# EasyEDA schematic Schematic_Open433_2020-06-17_01-57-08.json
TITLE: Sheet_1; REV: 1.0; Date: 2020-03-05; Sheet: 1/1; Drawn By: TurtleForGaming; Company: Your Company
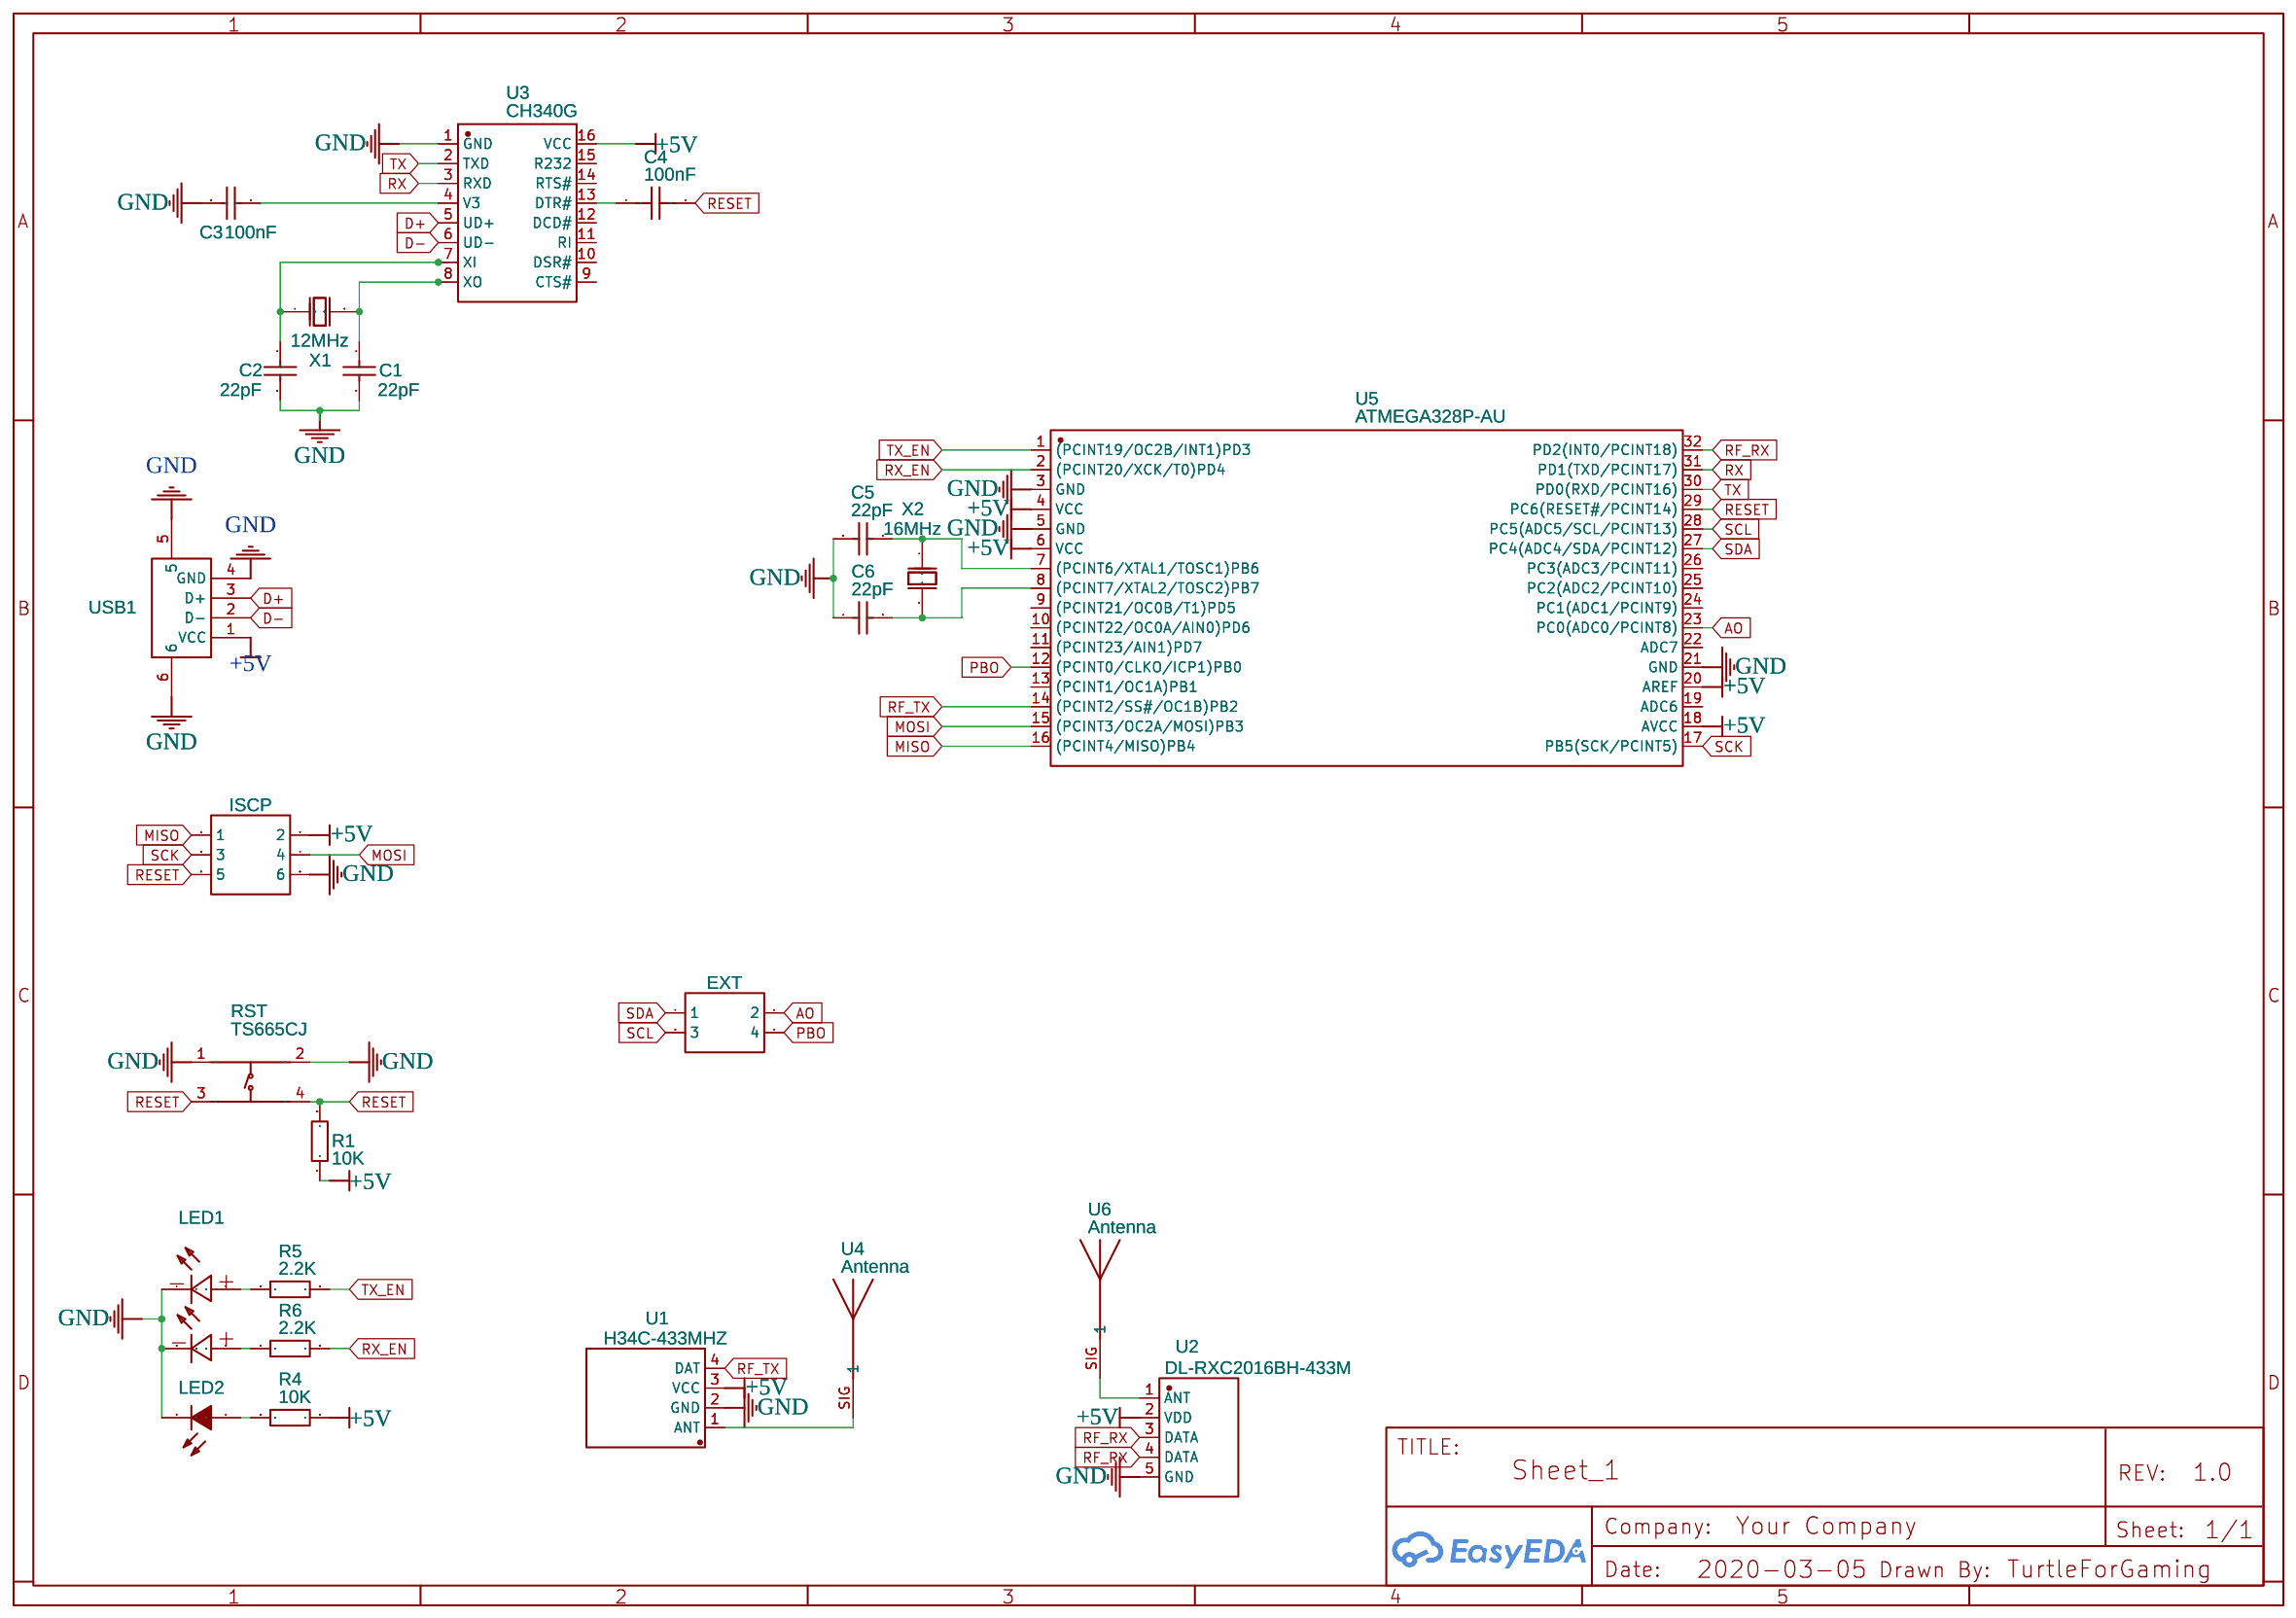
[diagram p0: schematic sheet]

## Parts
C1  22pF  [C1206]
C2  22pF  [C1206]
C3  100nF  [C1206]
C4  100nF  [C1206]
C5  22pF  [C1206]
C6  22pF  [C1206]
EXT  HDR-M-2.54_2x2  [HDR-M-2.54_2X2]
ISCP  Header-Female-2.54_2x3  [HDR-3X2/2.54]
LED1  19-223/Y2R6C-A01/2T  [LED-ARRAY-SMD_4P-L1.6-W1.5-TR-RD]
LED2  19-217/GHC-YR1S2/3T  [LED0603-R-RD]
R1  10K  [R1206]
R4  10K  [R1206]
R5  2.2K  [R0603]
R6  2.2K  [R0603]
RST  TS665CJ  [SW-TH_4P-L6.0-W6.0-P4.50-LS6.5]
U1  H34C-433MHZ  [WIRELM-TH_H34C-433MHZ]
U2  DL-RXC2016BH-433M  [WIRELM-TH_DL-RXC2016BH-433M]
U3  CH340G  [SOIC-16_L9.9-W3.9-P1.27-LS6.0-BL]
U4  Antenna  [PCBANTENNA]
U5  ATMEGA328P-AU  [TQFP-32_L7.0-W7.0-P0.80-LS9.0-BL]
U6  Antenna  [PCBANTENNA]
USB1  U217-04XN-XXR84  [USB-A-SMD_U217-041N-4BV81]
X1  12MHz  [HC-49S_L11.4-W4.8]
X2  16MHz  [HC-49S_L11.4-W4.8]

## Library data of the parts
C1 C2 C5 C6 = 1206CG220J500NT: Supplier: LCSC; Manufacturer: FH; Supplier Part: C1896
C3 = GRM31C5C1H104JA01L: Supplier: LCSC; Manufacturer: MuRata; Supplier Part: C97946
C4 = FM31X104K251EEG: Supplier: LCSC; Supplier Part: C365814; Manufacturer: Prosperity Dielectrics; Contributor: LCSC
EXT = HDR-M-2.54_2x2: Supplier Part: C66690; Supplier: LCSC; Contributor: LCEDA_Lib
ISCP = Header-Female-2.54_2x3: Supplier: LCSC; Manufacturer: CONNFLY; Manufacturer Part: DS1023-2*3SF11; Contributor: LCSC; Supplier Part: C92272
LED1 = 19-223/Y2R6C-A01/2T: Supplier: LCSC; Supplier Part: C282134; Manufacturer: Everlight Elec; Contributor: LCSC
LED2 = 19-217/GHC-YR1S2/3T: Supplier: LCSC; Manufacturer: EVERLIGHT; LCSC Assembly: Yes; image: //image.lceda.cn/szlcsc/C72043.jpg; Supplier Part: C72043; SMT Type: Basic
R1 R4 = CR-06JL7---10K: Supplier: LCSC; Supplier Part: C280032; Manufacturer: Viking Tech; Contributor: LCSC
R5 R6 = QR0603F2K2P05: Supplier: LCSC; Supplier Part: C176136; Manufacturer: Ever Ohms Tech; Contributor: LCSC
RST = TS665CJ: Supplier: LCSC; Supplier Part: C393938; Manufacturer: SHOU HAN; Contributor: LCSC
U1 = H34C-433MHZ: Supplier: LCSC; Supplier Part: C131030; Manufacturer: Shenzhen LCHSTAR Elec; Contributor: LCSC
U2 = DL-RXC2016BH-433M: Supplier: LCSC; Supplier Part: C381154; Manufacturer: DreamLNK; Contributor: LCSC
U3 = CH340G: Supplier: LCSC; Manufacturer: WCH; LCSC Assembly: Yes; image: //image.lceda.cn/szlcsc/C14267.jpg; Supplier Part: C14267; SMT Type: Basic
U4 U6 = Antenna: Manufacturer Part: ANT; Contributor: Gamer
U5 = ATMEGA328P-AU: Supplier: LCSC; Manufacturer: MICROCHIP; image: //image.lceda.cn/szlcsc/C14877.jpg; Supplier Part: C14877; LCSC Assembly: Yes; SMT Type: Extend
USB1 = U217-04XN-XXR84: Supplier: LCSC; Supplier Part: C319178; Manufacturer: XKB Enterprise; Contributor: LCSC
X1 = C12000J517: Supplier: LCSC; Supplier Part: C279578; Manufacturer: ZheJiang East Crystal Elec; Contributor: LCSC
X2 = 49MD-16.000-20-20-20/A: Supplier: LCSC; Supplier Part: C240963; Manufacturer: Suzhou Liming Elec; Contributor: LCSC

## Nets
+5V: ISCP.2 R1.1 R4.1 U1.3(VCC) U2.2(VDD) U3.16(VCC) U5.4(VCC) U5.6(VCC) U5.18(AVCC) U5.20(AREF) USB1.1(VCC)
GND: C1.2 C2.2 C3.1 C5.2 C6.1 ISCP.6 LED1.3 LED1.4 LED2.2(C) RST.1(A) RST.2(B) U1.2(GND) U2.5(GND) U3.1(GND) U5.3(GND) U5.5(GND) U5.21(GND) USB1.4(GND) USB1.5 USB1.6
AO: EXT.2 U5.23(PC0(ADC0/PCINT8))
D+: U3.5(UD+) USB1.3(D+)
D-: U3.6(UD-) USB1.2(D-)
MISO: ISCP.1 U5.16((PCINT4/MISO)PB4)
MOSI: ISCP.4 U5.15((PCINT3/OC2A/MOSI)PB3)
PBO: EXT.4 U5.12((PCINT0/CLKO/ICP1)PB0)
RESET: C4.2 ISCP.5 R1.2 RST.3(C) RST.4(D) U5.29(PC6(RESET#/PCINT14))
RF_RX: U2.3(DATA) U2.4(DATA) U5.32(PD2(INT0/PCINT18))
RF_TX: U1.4(DAT) U5.14((PCINT2/SS#/OC1B)PB2)
RX: U3.3(RXD) U5.31(PD1(TXD/PCINT17))
RX_EN: R6.2 U5.2((PCINT20/XCK/T0)PD4)
SCK: ISCP.3 U5.17(PB5(SCK/PCINT5))
SCL: EXT.3 U5.28(PC5(ADC5/SCL/PCINT13))
SDA: EXT.1 U5.27(PC4(ADC4/SDA/PCINT12))
TX: U3.2(TXD) U5.30(PD0(RXD/PCINT16))
TX_EN: R5.2 U5.1((PCINT19/OC2B/INT1)PD3)
Net-(C1-1): C1.1 U3.8(XO) X1.2(OSC2)
Net-(C2-1): C2.1 U3.7(XI) X1.1(OSC1)
Net-(C3-2): C3.2 U3.4(V3)
Net-(C4-1): C4.1 U3.13(DTR#)
Net-(C5-1): C5.1 U5.7((PCINT6/XTAL1/TOSC1)PB6) X2.1(OSC1)
Net-(C6-2): C6.2 U5.8((PCINT7/XTAL2/TOSC2)PB7) X2.2(OSC2)
Net-(LED1-1): LED1.1 R5.1
Net-(LED1-2): LED1.2 R6.1
Net-(LED2-1): LED2.1(A) R4.2
Net-(U1-1): U1.1(ANT) U4.SIG(1)
Net-(U2-1): U2.1(ANT) U6.SIG(1)

Not connected (* = marked no-connect by the designer): U3 9(CTS#) 10(DSR#) 11(RI) 12(DCD#) 14(RTS#) 15(R232); U5 9((PCINT21/OC0B/T1)PD5) 10((PCINT22/OC0A/AIN0)PD6) 11((PCINT23/AIN1)PD7) 13((PCINT1/OC1A)PB1) 19(ADC6) 22(ADC7) 24(PC1(ADC1/PCINT9)) 25(PC2(ADC2/PCINT10)) 26(PC3(ADC3/PCINT11))
